# Altium schematic sheet schem.SchDoc
size A4; SheetNumber: 1; SheetTotal: 1
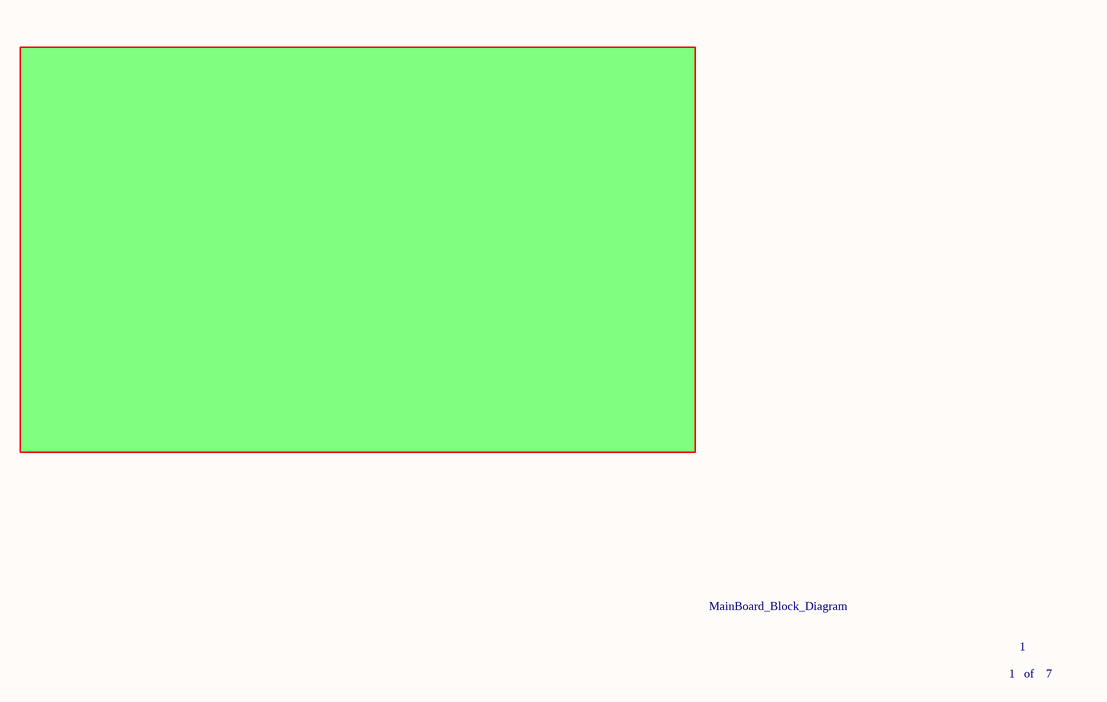
[diagram p0: schem.SchDoc]

## Sub-sheets
? = ?: no entries

## Notes on the sheet
- MainBoard_Block_Diagram
- 1   of    7
- 1